# EAGLE design can_adapter (EAGLE 7.4.0)
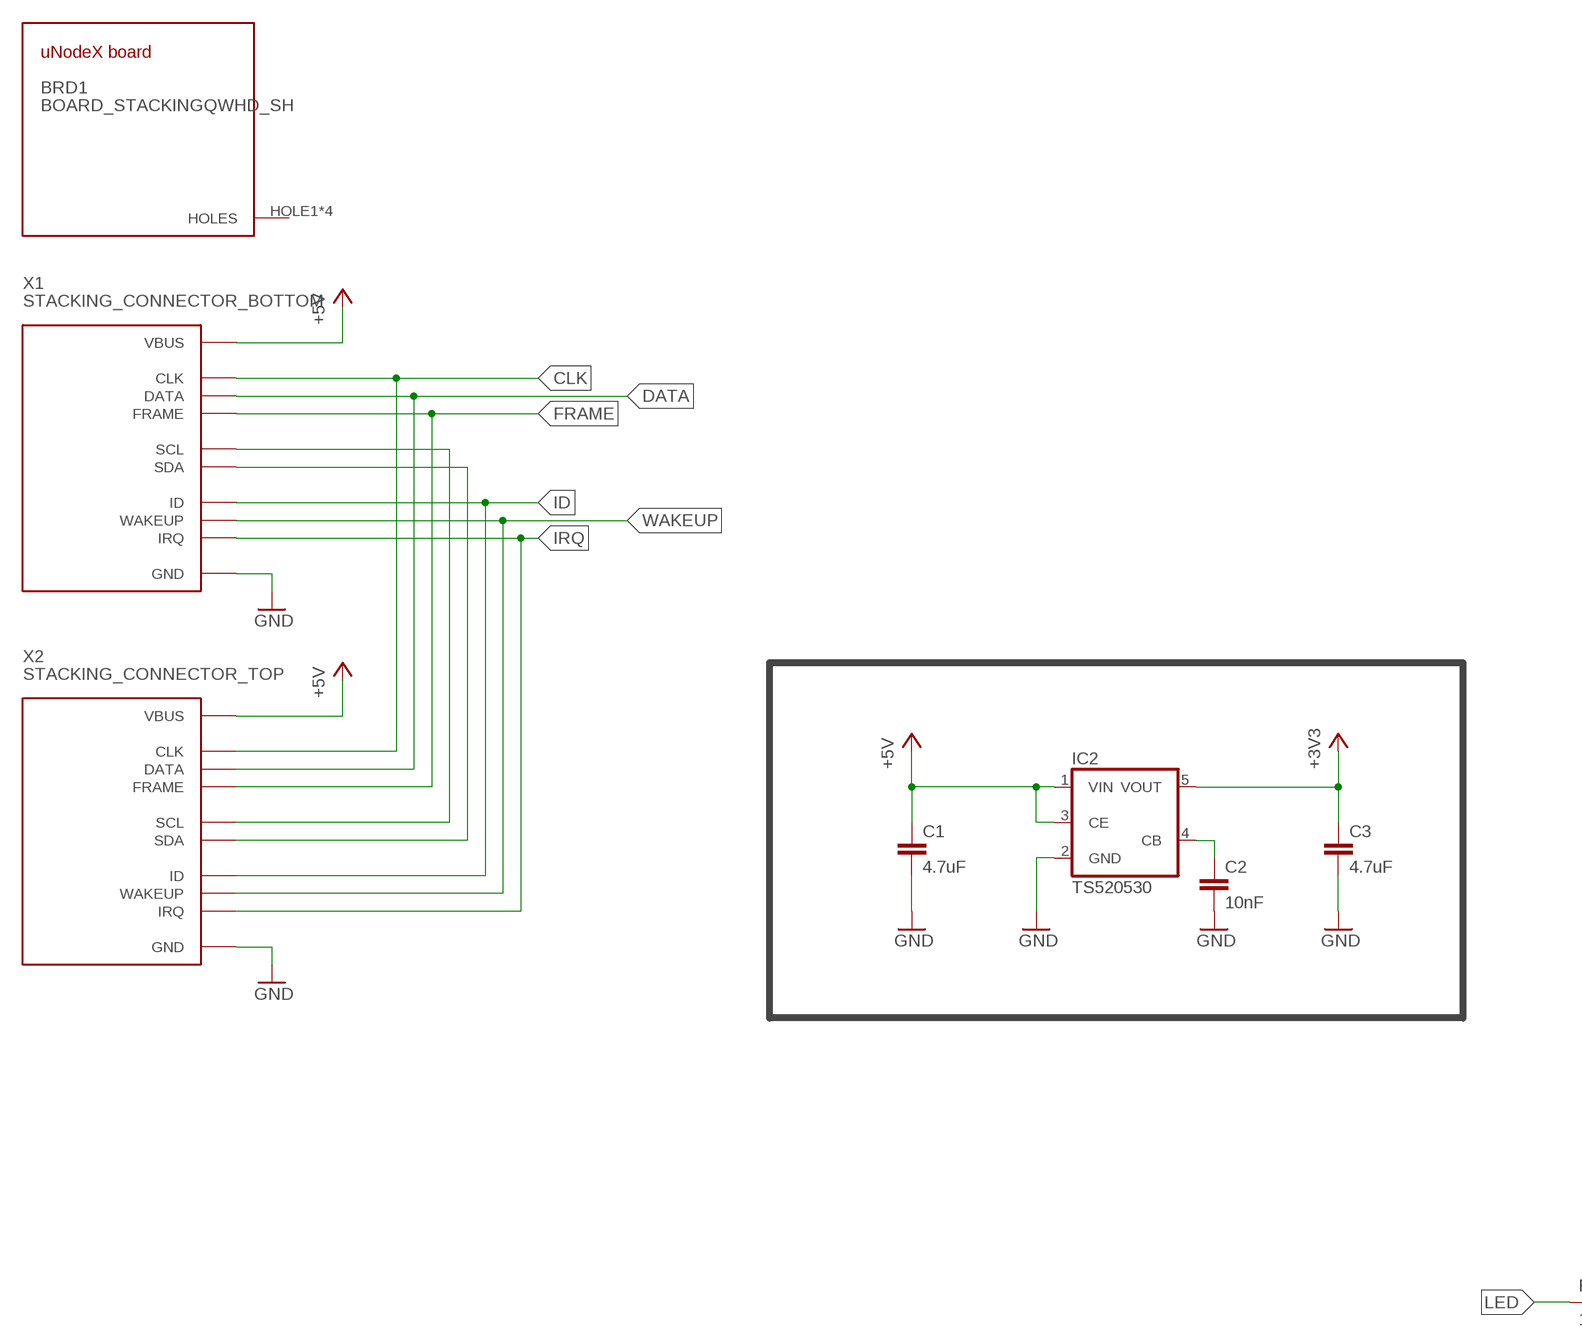
[diagram p0: schematic, sheet 1, part 1 of 2]
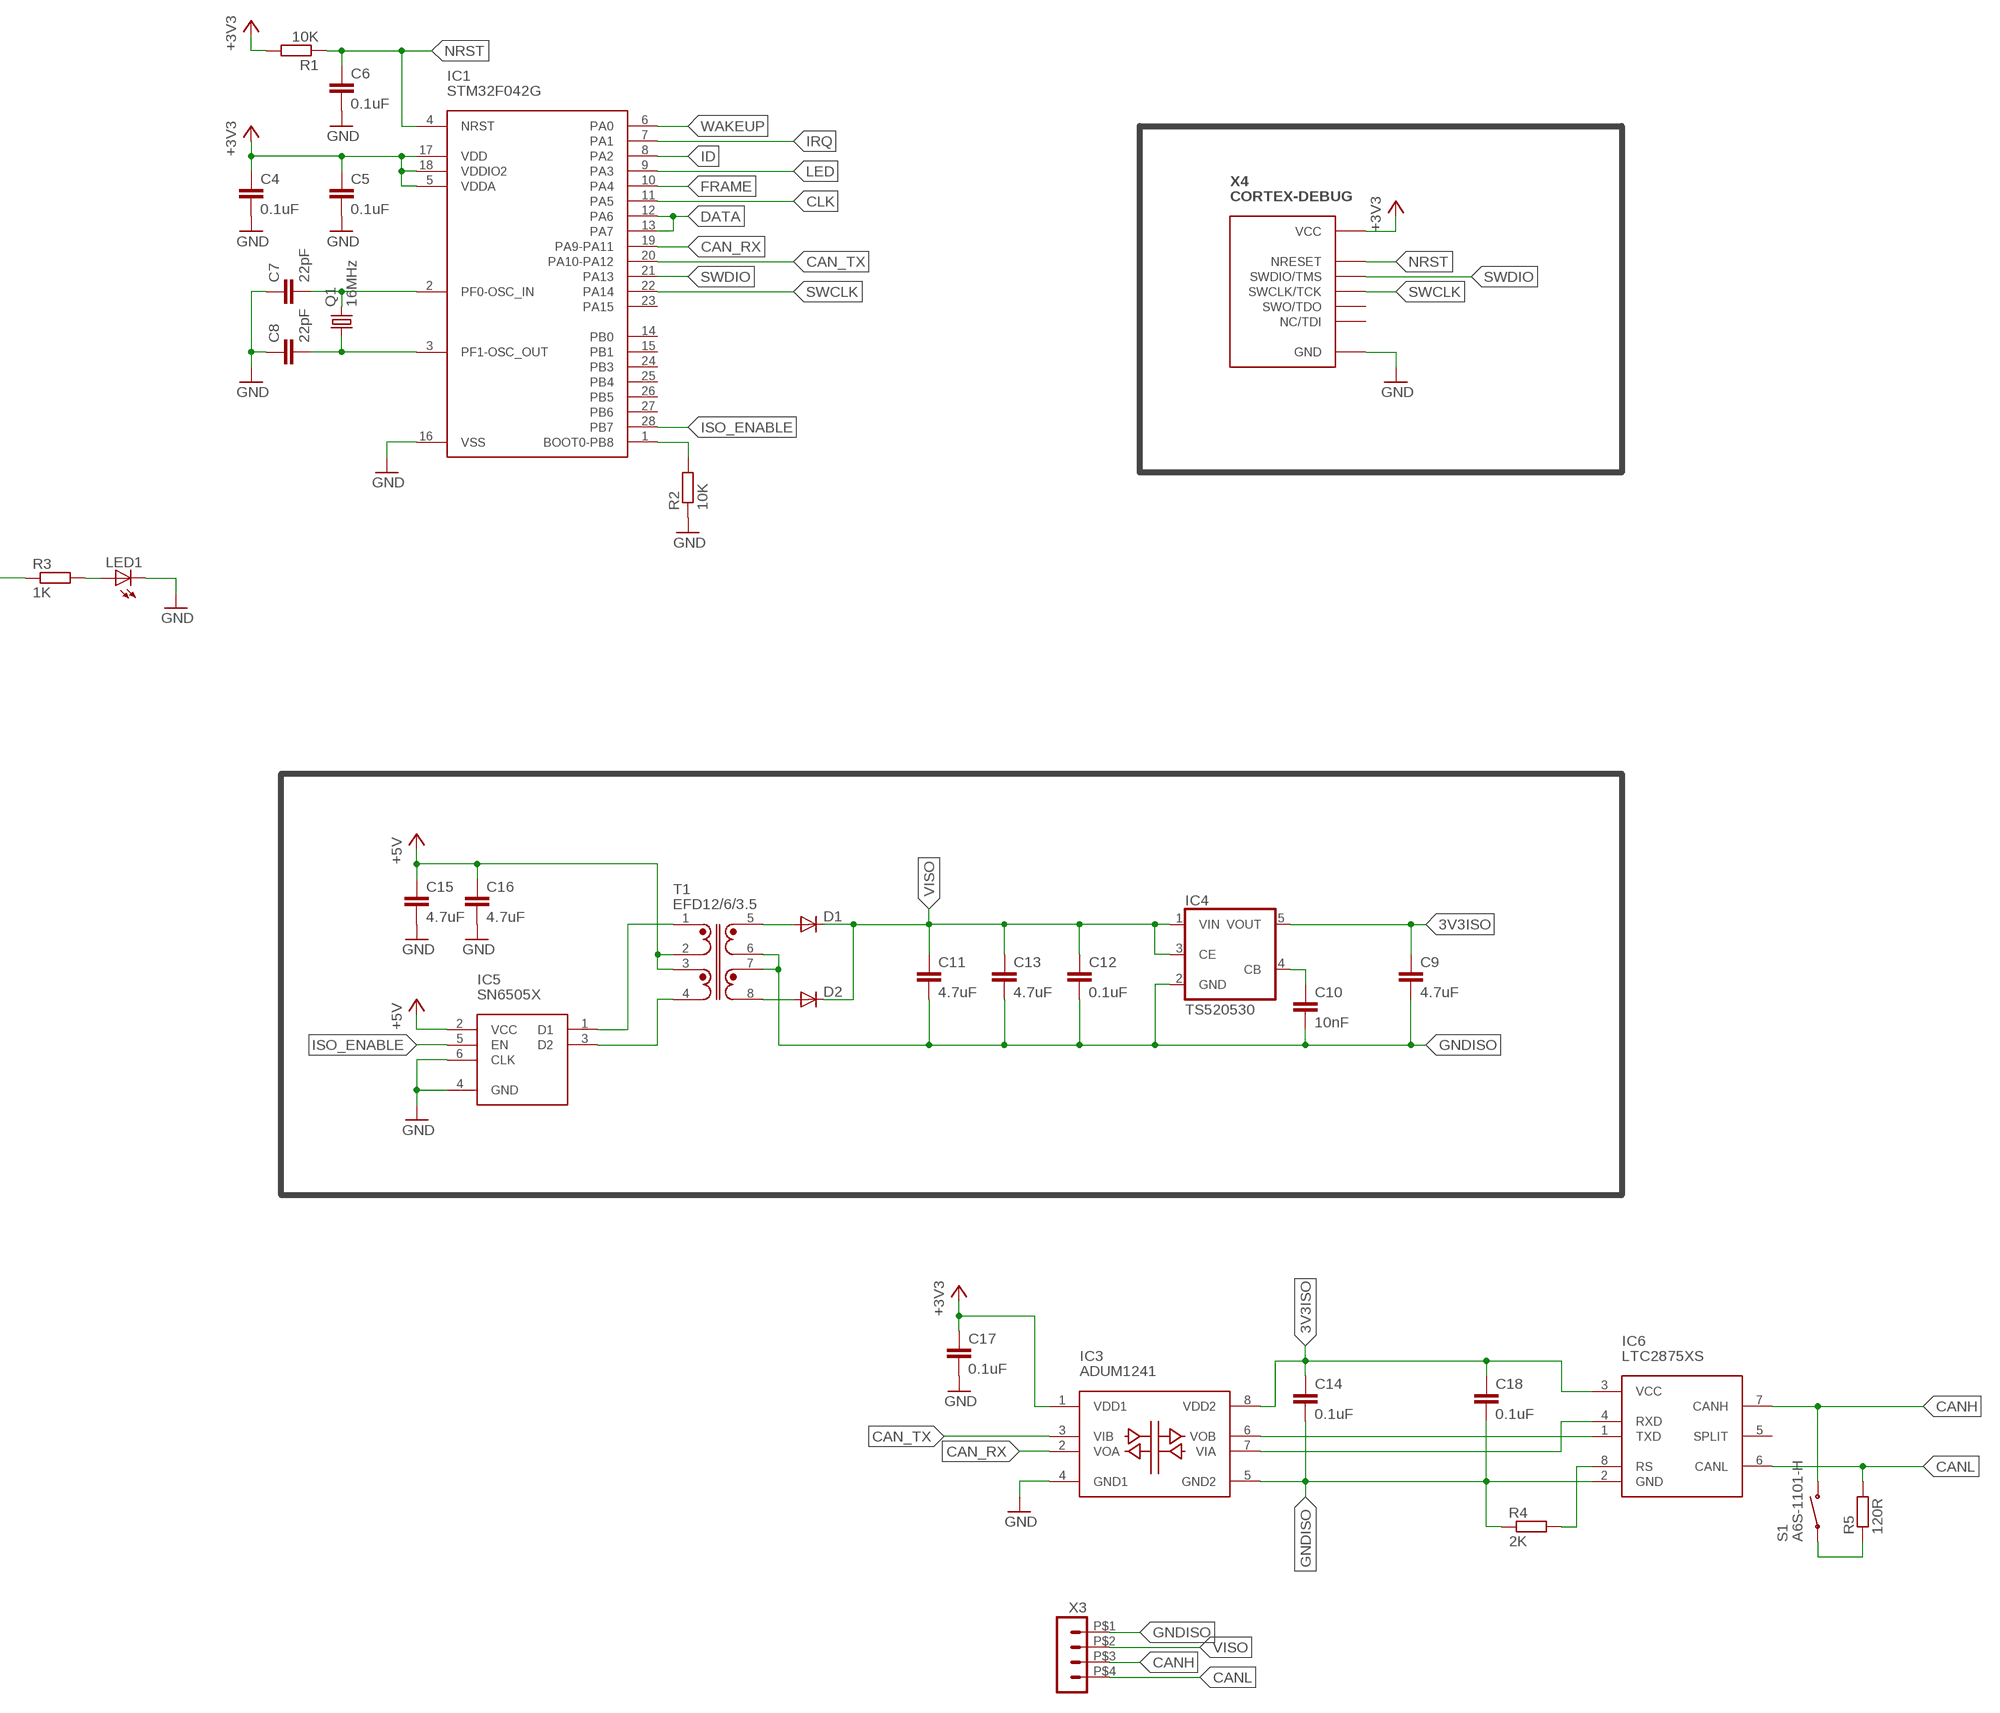
[diagram p1: schematic, sheet 1, part 2 of 2]

## Parts
BRD1  BOARD_STACKINGQWHD_SH  [QWHD_SHARP_CORNERS]
C1  4.7uF  C-EUC0805  [C0805]
C2  10nF  C-EUC0603  [C0603]
C3  4.7uF  C-EUC0805  [C0805]
C4  0.1uF  C-EUC0603  [C0603]
C5  0.1uF  C-EUC0603  [C0603]
C6  0.1uF  C-EUC0603  [C0603]
C7  22pF  C-EUC0603  [C0603]
C8  22pF  C-EUC0603  [C0603]
C9  4.7uF  C-EUC0805  [C0805]
C10  10nF  C-EUC0603  [C0603]
C11  4.7uF  C-EUC1206  [C1206]
C12  0.1uF  C-EUC0603  [C0603]
C13  4.7uF  C-EUC1206  [C1206]
C14  0.1uF  C-EUC0603  [C0603]
C15  4.7uF  C-EUC1206  [C1206]
C16  4.7uF  C-EUC1206  [C1206]
C17  0.1uF  C-EUC0603  [C0603]
C18  0.1uF  C-EUC0603  [C0603]
D1  DIODE-SOD323-W  [SOD323-W]
D2  DIODE-SOD323-W  [SOD323-W]
IC1  STM32F042G  [UFQFPN28]
IC2  TS520530  [SOT25]
IC3  ADUM1241  [SOIC8]
IC4  TS520530  [SOT25]
IC5  SN6505X  [SOT23-6]
IC6  LTC2875XS  [SOIC8]
LED1  LEDCHIPLED_0805  [CHIPLED_0805]
Q1  16MHz  XO_3225  [XTAL_3225]
R1  10K  R-EU_R0603  [R0603]
R2  10K  R-EU_R0603  [R0603]
R3  1K  R-EU_R0603  [R0603]
R4  2K  R-EU_R0603  [R0603]
R5  120R  R-EU_R0603  [R0603]
S1  A6S-1101-H  [A6S-1]
T1  EFD12/6/3.5  [EFD12/6/3.5]
X1  STACKING_CONNECTOR_BOTTOM  [HAR-FLEX-BOTTOM-12P]
X2  STACKING_CONNECTOR_TOP  [HAR-FLEX-TOP-12P]
X3  HEADER_POS4_43650-0400  [43650-0400]
X4  CORTEX-DEBUG  [CORTEX-DEBUG]

## Nets
3V3ISO: C9.1 C14.1 C18.1 IC3.8(VDD2) IC4.5(VOUT) IC6.3(VCC)
+3V3: C3.1 C4.1 C5.1 C17.1 IC1.5(VDDA) IC1.17(VDD) IC1.18(VDDIO2) IC2.5(VOUT) IC3.1(VDD1) R1.2 X4.VCC
+5V: C1.1 C15.1 C16.1 IC2.1(VIN) IC2.3(CE) IC5.2(VCC) T1.2 T1.3 X1.VBUS X2.VBUS
CAN_RX: IC1.19(PA9-PA11) IC3.2(VOA)
CAN_TX: IC1.20(PA10-PA12) IC3.3(VIB)
CANH: IC6.7(CANH) S1.1B(B) X3.P$3
CANL: IC6.6(CANL) R5.2 X3.P$4
CLK: IC1.11(PA5) X1.CLK X2.CLK
DATA: IC1.12(PA6) IC1.13(PA7) X1.DATA X2.DATA
FRAME: IC1.10(PA4) X1.FRAME X2.FRAME
GND: C1.2 C2.2 C3.2 C4.2 C5.2 C6.2 C7.1 C8.1 C15.2 C16.2 C17.2 IC1.16(VSS) IC2.2(GND) IC3.4(GND1) IC5.4(GND) IC5.6(CLK) LED1.C R2.1 X1.GND1(GND) X1.GND2(GND) X1.GND3(GND) X1.H1(GND) X1.H2(GND) X1.H3(GND) X1.H4(GND) X2.GND1(GND) X2.GND2(GND) X2.GND3(GND) X2.H1(GND) X2.H2(GND) X2.H3(GND) X2.H4(GND) X4.GND1(GND) X4.GND2(GND) X4.GND_DETECT(GND)
GNDISO: C9.2 C10.2 C11.2 C12.2 C13.2 C14.2 C18.2 IC3.5(GND2) IC4.2(GND) IC6.2(GND) R4.1 T1.6 T1.7 X3.P$1
ID: IC1.8(PA2) X1.ID X2.ID
IRQ: IC1.7(PA1) X1.IRQ X2.IRQ
ISO_ENABLE: IC1.28(PB7) IC5.5(EN)
LED: IC1.9(PA3) R3.1
N$1: IC5.3(D2) T1.4
N$2: LED1.A R3.2
N$3: IC3.6(VOB) IC6.1(TXD)
N$4: IC3.7(VIA) IC6.4(RXD)
N$5: IC6.8(RS) R4.2
N$6: R5.1 S1.1A(A)
N$9: C7.2 IC1.2(PF0-OSC_IN) Q1.3
N$10: C8.2 IC1.3(PF1-OSC_OUT) Q1.1
N$11: IC1.1(BOOT0-PB8) R2.2
N$13: C10.1 IC4.4(CB)
N$16: IC5.1(D1) T1.1
N$18: D1.A T1.5
N$19: D2.A T1.8
N$30: C2.1 IC2.4(CB)
NRST: C6.1 IC1.4(NRST) R1.1 X4.NRESET
SCL: X1.SCL X2.SCL
SDA: X1.SDA X2.SDA
SWCLK: IC1.22(PA14) X4.SWCLK/TCK
SWDIO: IC1.21(PA13) X4.SWDIO/TMS
VISO: C11.1 C12.1 C13.1 D1.C D2.C IC4.1(VIN) IC4.3(CE) X3.P$2
WAKEUP: IC1.6(PA0) X1.WAKEUP X2.WAKEUP
Unconnected: BRD1.HOLE1(HOLES) BRD1.HOLE2(HOLES) BRD1.HOLE3(HOLES) BRD1.HOLE4(HOLES) IC1.14(PB0) IC1.15(PB1) IC1.23(PA15) IC1.24(PB3) IC1.25(PB4) IC1.26(PB5) IC1.27(PB6) IC6.5(SPLIT) X4.NC/TDI X4.SWO/TDO

## Library data of the parts
BRD1 = unodex-boards:BOARD_STACKING
C1-C18 = rcl:C-EU: CAPACITOR, European symbol
D1 D2 = diode:DIODE-: DIODE
IC1 = stm32f042xx:STM32F042G
IC2 IC4 = v-reg:TS5205: 150mA Low Noise LDO Voltage Regulator with Enable TSC [Taiwan Semiconductor Company, Ltd] Source: http://www.taiwansemi.com .. 5205_0409c.pdf
IC3 = si84xx:ADUM1241
IC5 = transformer-drivers:SN6505X: SN6505 Low-Noise 1-A Transformer Drivers for Isolated Power Supplies The SN6505 is a low-noise, low-EMI push-pull transformer driver, specifically designed for small form factor, isolated power supplies. It drives low- profile, center-tapped transformers from a 2.25 V to 5 V DC power supply. Ultra-low noise and EMI are achieved by slew rate control of the output switch voltage and through Spread Spectrum Clocking (SSC). The SN6505 consists of an oscillator followed by a gate drive circuit that provides the complementary output signals to drive ground- referenced N-channel power switches. The device includes two 1-A Power-MOSFET switches to ensure start-up under heavy loads. The switching clock can also be provided externally for accurate placement of switcher harmonics, or when operating with multiple transformer drivers. The internal protection features include a 1.7A current limiting, under-voltage lockout, thermal shutdown, and break-before-make circuitry. SN6505 includes a soft-start feature that prevents high inrush current during power up with large load capacitors. The SN6505 is available in a small 6-pin SOT23/DBV package. The device operation is characterized for a temperature range from –55°C to 125°C.
IC6 = can-transceivers:LTC2875
LED1 = led:LED: LED OSRAM: - CHIPLED LG R971, LG N971, LY N971, LG Q971, LY Q971, LO R971, LY R971 LH N974, LH R974 LS Q976, LO Q976, LY Q976 LO Q996 - Hyper CHIPLED LW Q18S LB Q993, LB Q99A, LB R99A - SideLED LS A670, LO A670, LY A670, LG A670, LP A670 LB A673, LV A673, LT A673, LW A673 LH A674 LY A675 LS A676, LA A676, LO A676, LY A676, LW A676 LS A679, LY A679, LG A679 - Hyper Micro SIDELED® LS Y876, LA Y876, LO Y876, LY Y876 LT Y87S - SmartLED LW L88C, LW L88S LB L89C, LB L89S, LG L890 LS L89K, LO L89K, LY L89K LS L896, LA L896, LO L896, LY L896 - TOPLED LS T670, LO T670, LY T670, LG T670, LP T670 LSG T670, LSP T670, LSY T670, LOP T670, LYG T670 LG T671, LOG T671, LSG T671 LB T673, LV T673, LT T673, LW T673 LH T674 LS T676, LA T676, LO T676, LY T676, LB T676, LH T676, LSB T676, LW T676 LB T67C, LV T67C, LT T67C, LS T67K, LO T67K, LY T67K, LW E67C LS E67B, LA E67B, LO E67B, LY E67B, LB E67C, LV E67C, LT E67C LW T67C LS T679, LY T679, LG T679 LS T770, LO T770, LY T770, LG T770, LP T770 LB T773, LV T773, LT T773, LW T773 LH T774 LS E675, LA E675, LY E675, LS T675 LS T776, LA T776, LO T776, LY T776, LB T776 LHGB T686 LT T68C, LB T68C - Hyper Mini TOPLED® LB M676 - Mini TOPLED Santana® LG M470 LS M47K, LO M47K, LY M47K Source: http://www.osram.convergy.de LUXEON: - LUMILED® LXK2-PW12-R00, LXK2-PW12-S00, LXK2-PW14-U00, LXK2-PW14-V00 LXK2-PM12-R00, LXK2-PM12-S00, LXK2-PM14-U00 LXK2-PE12-Q00, LXK2-PE12-R00, LXK2-PE12-S00, LXK2-PE14-T00, LXK2-PE14-U00 LXK2-PB12-K00, LXK2-PB12-L00, LXK2-PB12-M00, LXK2-PB14-N00, LXK2-PB14-P00, LXK2-PB14-Q00 LXK2-PR12-L00, LXK2-PR12-M00, LXK2-PR14-Q00, LXK2-PR14-R00 LXK2-PD12-Q00, LXK2-PD12-R00, LXK2-PD12-S00 LXK2-PH12-R00, LXK2-PH12-S00 LXK2-PL12-P00, LXK2-PL12-Q00, LXK2-PL12-R00 Source: www.luxeon.com KINGBRIGHT: KA-3528ASYC Source: www.kingbright.com
Q1 = crystals:XO_3225
R1-R5 = rcl:R-EU_: RESISTOR, European symbol
S1 = omron-a6s:A6S-1101-H
T1 = transformers:EFD12/6/3.5
X1 = unodex-boards:STACKING_CONNECTOR_BOTTOM
X2 = unodex-boards:STACKING_CONNECTOR_TOP
X3 = con-molex-micro-fit-3_0:HEADER_POS4_?: Molex - Micro-Fit 3.0 Series connector, 3.00mm (0.118") pitch header, 4 positions.
X4 = debug-connectors:CORTEX-DEBUG

## Net classes
0 default: width 0.2 mm, drill 0.3 mm, clearance 0.15 mm

## Board
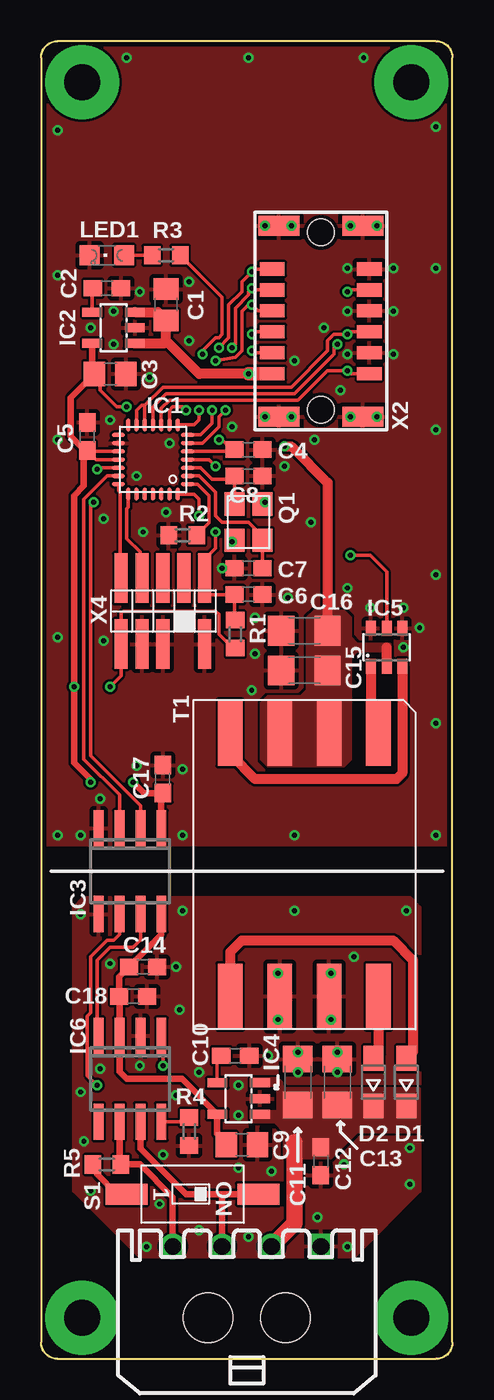
[diagram p2: board, top side]
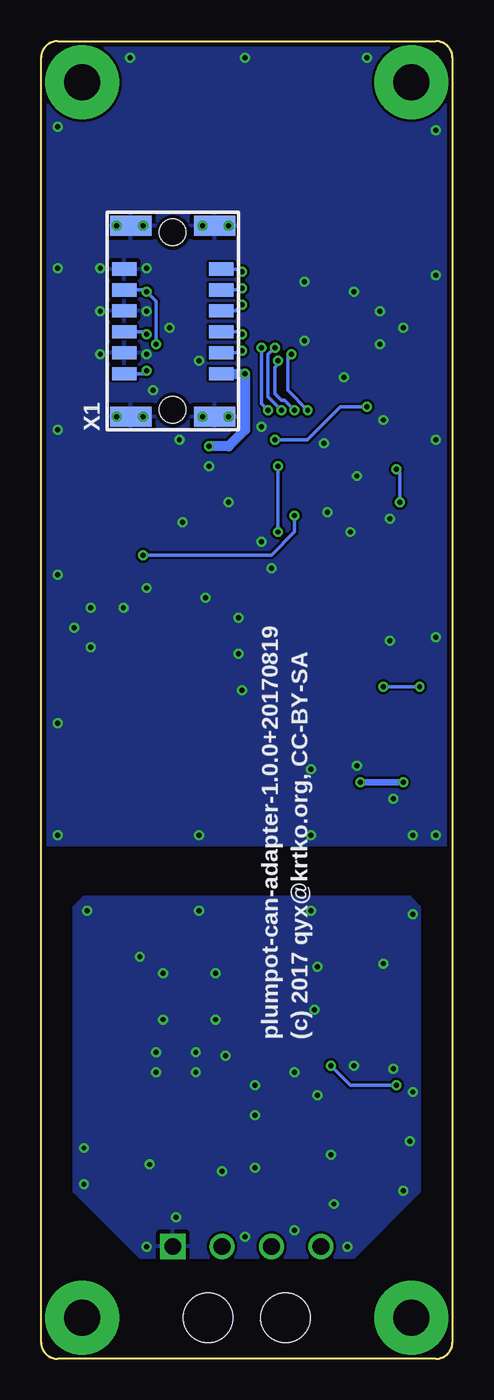
[diagram p3: board, bottom side, seen from below]

Size 25 x 80 mm. Coordinates in mm from the lower left corner, seen from the top.
Copper layers (1*16): Top 0.035mm / dielectric 1.5mm / Bottom 0.035mm
Design rules "seeed *": minimum track width 0.2mm, minimum drill 0.3mm, track to track 0.15mm, track to pad 0.15mm, pad to pad 0.15mm, via to via 0.15mm, smd to smd 0mil, copper to edge 10mil, drill to drill 10mil, minimum pad ring 6mil, minimum via ring 6mil, stop-mask expansion 2mil, vias tented up to drill 0.5mm, thermal gap 10mil

### Footprints (pad centres in the part's own frame; a part is rotated, then mirrored left to right if it is on the bottom)
QWHD_SHARP_CORNERS = drill 2.2 pad 4.5: HOLE1 2.5,2.5; HOLE2 22.5,2.5; HOLE3 22.5,77.5; HOLE4 2.5,77.5
C0805 = smd 1.3 x 1.5: 1 -0.95,0; 2 0.95,0
C0603 = smd 1.1 x 1: 1 -0.85,0; 2 0.85,0
C1206 = smd 1.6 x 1.8: 1 -1.4,0; 2 1.4,0
SOD323-W = smd 1.5 x 1.2: A 1.45,0; C -1.45,0
UFQFPN28 = smd 0.8 x 0.25: 1 -2.1,1.5; 2 -2.1,1; 3 -2.1,0.5; 4 -2.1,0; 5 -2.1,-0.5; 6 -2.1,-1; 7 -2.1,-1.5; 15 2.1,-1.5; 16 2.1,-1; 17 2.1,-0.5; 18 2.1,0; 19 2.1,0.5; 20 2.1,1; 21 2.1,1.5 | smd 0.25 x 0.8: 8 -1.5,-2.1; 9 -1,-2.1; 10 -0.5,-2.1; 11 0,-2.1; 12 0.5,-2.1; 13 1,-2.1; 14 1.5,-2.1; 22 1.5,2.1; 23 1,2.1; 24 0.5,2.1; 25 0,2.1; 26 -0.5,2.1; 27 -1,2.1; 28 -1.5,2.1
SOT25 = smd 0.55 x 1.2: 1 -0.95,-1.3; 2 0,-1.3; 3 0.95,-1.3; 4 0.95,1.3; 5 -0.95,1.3
SOIC8 = smd 0.6 x 2.2: 1 -1.905,-2.6; 2 -0.635,-2.6; 3 0.635,-2.6; 4 1.905,-2.6; 5 1.905,2.6; 6 0.635,2.6; 7 -0.635,2.6; 8 -1.905,2.6
SOT23-6 = smd 0.6 x 0.9: 1 -0.95,-1.15; 2 0,-1.15; 3 0.95,-1.15; 4 0.95,1.15; 5 0,1.15; 6 -0.95,1.15
CHIPLED_0805 = smd 1.2 x 1.2: A 0,-1.05; C 0,1.05
XTAL_3225 = smd 1.4 x 1.2: 1 -1.1,-0.85; 2 1.1,-0.85; 3 1.1,0.85; 4 -1.1,0.85
R0603 = smd 1 x 1.1: 1 -0.85,0; 2 0.85,0
A6S-1 = smd 1.27 x 2.54: 1A 0,-4; 1B 0,4
EFD12/6/3.5 = smd 4 x 1.5: 1 -8,4.5; 2 -8,1.5; 3 -8,-1.5; 4 -8,-4.5; 5 8,-4.5; 6 8,-1.5; 7 8,1.5; 8 8,4.5
HAR-FLEX-BOTTOM-12P = smd 1.5 x 0.8 bottom: CLK -5.05,-15.105; DATA -5.05,-17.645; FRAME -5.05,-20.185; GND1 -5.05,-13.835; GND2 -5.05,-16.375; GND3 -5.05,-18.915; ID -10.95,-16.375; IRQ -10.95,-13.835; SCL -10.95,-17.645; SDA -10.95,-18.915; VBUS -10.95,-20.185; WAKEUP -10.95,-15.105 | smd 2.5 x 1.2 bottom: H1 -10.55,-22.8; H2 -5.45,-22.8; H3 -5.45,-11.2; H4 -10.55,-11.2 | hole 1.6: -8,-11.615; -8,-22.385
HAR-FLEX-TOP-12P = smd 1.5 x 0.8: CLK -5.05,-15.105; DATA -5.05,-17.645; FRAME -5.05,-20.185; GND1 -5.05,-13.835; GND2 -5.05,-16.375; GND3 -5.05,-18.915; ID -10.95,-16.375; IRQ -10.95,-13.835; SCL -10.95,-17.645; SDA -10.95,-18.915; VBUS -10.95,-20.185; WAKEUP -10.95,-15.105 | smd 2.5 x 1.2: H1 -10.55,-22.8; H2 -5.45,-22.8; H3 -5.45,-11.2; H4 -10.55,-11.2 | hole 1.6: -8,-11.615; -8,-22.385
43650-0400 = drill 1.02 square: P$1 4.5,4.32 | drill 1.02: P$2 1.5,4.32; P$3 -1.5,4.32; P$4 -4.5,4.32 | hole 3: 2.35,0; -2.35,0
CORTEX-DEBUG = smd 0.8 x 3: GND1 -1.27,-2; GND2 0,-2; GND_DETECT 2.54,-2; NC/TDI 1.27,2; NRESET 2.54,2; SWCLK/TCK -1.27,2; SWDIO/TMS -2.54,2; SWO/TDO 0,2; VCC -2.54,-2

### Placement (x,y rotation side)
BRD1  0,0 0 top
C1  7.6,64 90 top
C2  4,65 0 top
C3  4.2,59.8 0 top
C4  12.6,55.2 0 top
C5  2.8,56 90 top
C6  12.6,46.4 0 top
C7  12.6,48 0 top
C8  12.6,53.6 180 top
C9  12.2,13 0 top
C10  11.8,18.4 0 top
C11  15.6,16.8 90 top
C12  17,12 270 top
C13  18,16.8 90 top
C14  6.2,23.8 0 top
C15  16,41.8 180 top
C16  16,44.2 180 top
C17  7.4,35.2 90 top
C18  5.6,22 0 top
D1  22.2,16.8 90 top
D2  20.2,16.8 90 top
IC1  6.8,54.6 180 top
IC2  4.4,62.6 90 top
IC3  5.4,29.6 180 top
IC4  12,15.8 90 top
IC5  21,43.2 0 top
IC6  5.4,17 180 top
LED1  4,67 90 top
Q1  12.6,50.8 270 top
R1  11.8,44 270 top
R2  8.6,50 0 top
R3  7.6,67 180 top
R4  9,13.8 90 top
R5  4,11.8 0 top
S1  9.2,10 270 top
T1  16,30 270 top
X1  25,80 0 top
X2  25,80 0 top
X3  12.5,2.5 0 top
X4  7.4,45.4 0 top

### Tracks (layer width: path | path; a pad name or v marks a point on that pad's centre or on a via)
3V3ISO
  Top 0.406: IC3.8 7.3,25.75 C14.1 4.75,23.2 C18.1 4.76,21.98 IC6.3 4.76,17.43 5.2,17 8.55,17 IC4.5 10.7,13.65 11.25,13.1 C9.1
+3V3  (via drill 0.3)
  Top 0.2: IC1.5 11.65,55.1 C4.1 11.6,55.2 11,55.8 v10.8,55.8 | IC1.17 2.85,55.1 C5.1 | IC1.18 3.35,54.6 C5.1 | R1.2 11.65,43.15 10.8,44 10.8,45.2 10.6,45.4 5,45.4 4.86,45.26 X4.VCC 4.86,41.46 v4.2,40.8 | C5.1 2.65,55.15 | v5.2,57.8 4.6,57.8 3.6,58.8 3.6,59.45 C3.1
  Top 0.406: IC2.5 3.1,59.95 C3.1 1.8,58.35 1.8,56 2.65,55.15 | C5.1 2.8,54.8 2.6,54.6 2.6,53 2,52.4 v2,40.8 2,36.2 3,35.2 v3,35 | v5.6,35 6.25,34.35 C17.1 7.3,34.26 IC3.1
  Bottom 0.2: v10.8,55.8 8.8,55.8 6.8,57.8 v5.2,57.8 | v2,40.8 v4.2,40.8
  Bottom 0.406: v3,35 v5.6,35
+5V  (via drill 0.3)
  Top 0.61: v12.6,59.8 9.6,59.8 7.6,61.8 | v14.8,55.4 15.2,55.4 17.4,53.2 C16.1 | IC2.3 7.1,63.55 C1.1 7.6,61.8 | IC2.1 7.45,61.65 7.6,61.8 | IC5.2 21,43.2
  Top 0.813: X2.VBUS 12.62,59.81 v12.6,59.8
  Bottom 0.61: X2.VBUS 12.62,59.81 v12.6,59.8 12.6,56.4 13.6,55.4 v14.8,55.4
  pour Top (no thermals): 13.8,36 18.4,36 18.8,36.4 18.8,42.6 19.2,43 21.2,43 21.2,43.4 19.2,43.4 18.8,43.8 18.8,45 18.4,45.4 16.6,45.4 16.2,45 16.2,40.6 15.8,40.2 13.8,40.2 13.4,39.8 13.4,36.4
CAN_RX  (via drill 0.3)
  Top 0.2: IC3.2 6.04,33.56 3,36.6 3,51.8 v3.2,52 | IC1.19 3.5,54.1 v3.4,54
  Bottom 0.2: v3.2,52 3.2,53.8 v3.4,54
CAN_TX
  Top 0.2: IC3.3 4.76,34.23 2.6,36.4 2.6,52.2 4,53.6 IC1.20
CANH
  Top 0.406: IC6.7 6.04,12.77 8.8,10 11,10 | X3.P$3 11,10 | 11,10 S1.1B
CANL
  Top 0.406: X3.P$4 8,9.8 6,11.8 R5.2 4.76,11.88 IC6.6
CLK  (via drill 0.3)
  Top 0.2: IC1.11 6.8,57.8 7.6,58.6 15.4,58.6 17.8,61 17.8,61.4 v18,61.6 | X2.CLK 18.7,64.89 v18.6,64.8
  Bottom 0.2: X2.CLK 18.7,64.89 v18.6,64.8 18,64.2 v18,61.6
DATA  (via drill 0.3)
  Top 0.2: IC1.12 6.3,57.9 | 6.3,57.9 7.4,59 15.2,59 17.4,61.2 17.4,61.8 17.8,62.2 v18.6,62.2 18.75,62.35 X2.DATA | IC1.13 5.8,57.6 6.1,57.9 6.3,57.9
  Bottom 0.2: X2.DATA 18.75,62.35 v18.6,62.2
FRAME  (via drill 0.3)
  Top 0.2: IC1.10 7.3,57.7 7.8,58.2 15.6,58.2 17.4,60 v18.6,60 18.79,59.81 X2.FRAME
  Bottom 0.2: X2.FRAME 18.79,59.81 v18.6,60
GND  (via drill 0.3)
  other vias: 1,31.8 2.4,31.8 8.6,31.8 15.4,31.8 24,31.8 24,38.6 24,47.6 24,56.4 13.6,57.2 15.2,57.2 18.8,57.2 20.4,57.2 24,66.2 24,74.8 19.6,79 12.6,79 5.2,79 1,74.6 1,65.8 1,55.8 1,43.8 15.2,68.8 13.6,68.8 18.8,68.8 20.4,68.8 18.6,66.2 21.4,66.2 18.6,63.6 18.6,61 21.4,61 21.4,63.6 5.8,53.6 7.8,55.6 6.2,50.2 7.6,51.4 20,45.6 22,43.2 23,44.4 22,45.6 14.8,54.2 16.6,55.8 15,46.2 12.8,40.6 13,42.8 13,45 11.6,49.6 16.4,50.8 18.6,46.8 4.2,57 11.6,56.6 15.4,60.6 18.2,58.8 4.4,63.6 4.4,61.6 3,62.6 6.6,59.6 6,64.8 9,65.4 11,48 9,61.8 17.2,62.6 13.6,52 3.6,34 5.8,36 8.6,35.8 3.8,43.6 3.8,51
  pour Top (rank 2): 0,31.2 25,31.2 25,80 0,80
  pour Bottom (rank 2): 0,31.2 25,31.2 25,80 0,80
GNDISO  (via drill 0.3)
  other vias: 2.6,13.2 12,11.6 14,11.4 12,14.8 12,16.6 13.8,18.4 14.4,23.4 14.4,20.6 17.6,20.6 17.6,23.4 22.2,27.2 15.4,27.2 8.6,27.2 2.4,27 2.4,16.2 18.6,6.8 12.6,7.4 6.4,6.8 22.4,10.6 22.4,12.8 15.6,18.6 18,18.6 8.2,23.8 8.4,21.2 16.8,8.6 18.4,11.8 19,24.4 18,17.4 15.6,17.4 6,17.8 3.6,17.6 8.2,16 7.2,9.4 7.4,12.4 9.6,7.8 3,10.2 9.6,17.4 4.2,24
  pour Top (rank 2): 2.6,28 22.4,28 23,27.4 23,10.2 19,6.2 6,6.2 2,10.2 2,27.4
  pour Bottom (rank 2): 2.6,28 22.4,28 23,27.4 23,10.2 19,6.2 6,6.2 2,10.2 2,27.4
ID  (via drill 0.3)
  Top 0.2: X2.ID 13.18,63.62 v12.8,64 12.6,64 12.2,63.6 12.2,61.2 11.8,60.8 v10.6,60.6 | IC1.8 9.3,56.7 9.6,57 v9.6,57.6
  Bottom 0.2: X2.ID 13.18,63.62 v12.8,64 | v10.6,60.6 10.6,60.4 10.8,60.2 10.8,58.6 10.4,58.2 10.2,58.2 v9.6,57.6
IRQ  (via drill 0.3)
  Top 0.2: IC1.7 9.7,56.1 10.4,56.8 v10.4,57.6 | X2.IRQ 12.96,66.17 v12.8,66 12.2,65.4 12.2,64.8 11.4,64 11.4,62 v10.8,61.4
  Bottom 0.2: X2.IRQ 12.96,66.17 v12.8,66 | v10.8,61.4 11.2,61 11.2,58.4 v10.4,57.6
ISO_ENABLE  (via drill 0.3)
  Top 0.2: v18.8,48.8 20,48.8 21,47.8 IC5.5 | IC1.28 9.3,52.5 9.6,52.2 v9.6,51.2
  Bottom 0.2: v9.6,51.2 9.6,50.2 11,48.8 v18.8,48.8
LED  (via drill 0.3)
  Top 0.2: IC1.9 7.8,57.6 8,57.8 8.6,57.8 v8.8,57.6 | R3.1 11,64.45 11,62.2 10.8,62 10.6,62 9.8,61.2 v9.8,61
  Bottom 0.2: v8.8,57.6 10,58.8 10,60.8 v9.8,61
N$1
  Top 0.61: IC5.3 21.95,35.55 21.6,35.2 13,35.2 11.6,36.6 11.6,37.9 T1.4
N$2
  Top 0.2: LED1.A R3.2
N$3  (via drill 0.3)
  Top 0.2: IC3.6 4.76,25.77 4.4,25.4 4,25.4 3,24.4 3,21 2.8,20.8 2.8,17.2 v3.4,16.6 | v7.4,17.8 7.4,19.5 IC6.1
  Bottom 0.2: v3.4,16.6 6.2,16.6 v7.4,17.8
N$4
  Top 0.2: IC3.7 6.04,25.43 5.6,25 4.2,25 3.4,24.2 3.4,19.7 IC6.4
N$5
  Top 0.2: IC6.8 8.75,14.4 R4.2
N$6
  Top 0.406: S1.1A 4.6,10 3.4,11.2 3.4,11.55 R5.1
N$9
  Top 0.2: IC1.2 9.6,53.6 10.6,52.6 10.6,51.2 11,50.8 12.6,50.8 13.45,49.95 Q1.3 C7.2
N$10
  Top 0.2: IC1.3 9.7,54.1 10.4,53.4 11.55,53.4 C8.2 Q1.1
N$11
  Top 0.2: IC1.1 9.5,53.1 10.2,52.4 10.2,50.75 R2.2
N$13
  Top 0.2: IC4.4 10.7,18.15 C10.1
N$16
  Top 0.61: IC5.1 20.05,38.45 T1.1
N$18
  Top 0.61: T1.5 11.5,24.7 12.2,25.4 21.4,25.4 22.6,24.2 22.6,18.65 D1.A
N$19
  Top 0.61: T1.8 20.5,18.55 D2.A
N$30
  Top 0.2: IC2.4 3.1,64.95 C2.1
NRST  (via drill 0.3)
  Top 0.2: IC1.4 10.2,54.6 v10.6,54.2 | R1.1 11.75,44.9 C6.1 10.2,46.4 10,46.6 10,47.34 X4.NRESET 9.94,48.54 10.6,49.2 v10.6,50.2
  Bottom 0.2: v10.6,54.2 v10.6,50.2
SCL  (via drill 0.3)
  Top 0.2: X2.SCL 12.96,62.35 v12.8,62.2
  Bottom 0.2: X2.SCL 12.96,62.35 v12.8,62.2
SDA  (via drill 0.3)
  Top 0.2: X2.SDA 12.91,61.09 v12.8,61.2
  Bottom 0.2: X2.SDA 12.91,61.09 v12.8,61.2
SWCLK
  Top 0.2: IC1.22 5.3,51.7 5.2,51.6 5.2,49.8 6,49 6,47.53 X4.SWCLK/TCK
SWDIO
  Top 0.2: IC1.21 4.7,52.7 4.8,52.6 4.8,47.46 X4.SWDIO/TMS
VISO
  Top 1.016: 15.4,13.15 15.4,8.22 X3.P$2
  pour Top (no thermals): 14.8,16.4 23,16.4 23,13.8 19.2,13.8 17.6,12.2 15,12.2 14.8,12.4 14.8,13.8 14.2,14.4 12.8,14.4 12.8,15 14.4,15 14.4,16.6 12.8,16.6 12.8,17 14.4,17 14.6,16.8 14.6,16.6
WAKEUP  (via drill 0.3)
  Top 0.2: IC1.6 9.8,55.6 10.8,56.6 10.8,57.2 v11.2,57.6 | X2.WAKEUP 12.9,64.89 v12.8,65 12.6,64.8 12.6,64.6 11.8,63.8 11.8,61.6 v11.6,61.4
  Bottom 0.2: X2.WAKEUP 12.9,64.89 v12.8,65 | v11.6,61.4 11.6,58 v11.2,57.6

### Text on the board
bPlace: (c) 2017 qyx@krtko.org, CC-BY-SA | plumpot-can-adapter-1.0.0+20170819